# EasyEDA Pro project 磁感应板-1.0.eprj

# Schematic Schematic1
Create Date: 2023-02-28; Page Name: P1; Project Name: 磁感应板-1.0; Schematic Name: Schematic1; Update Date: 2023-04-02
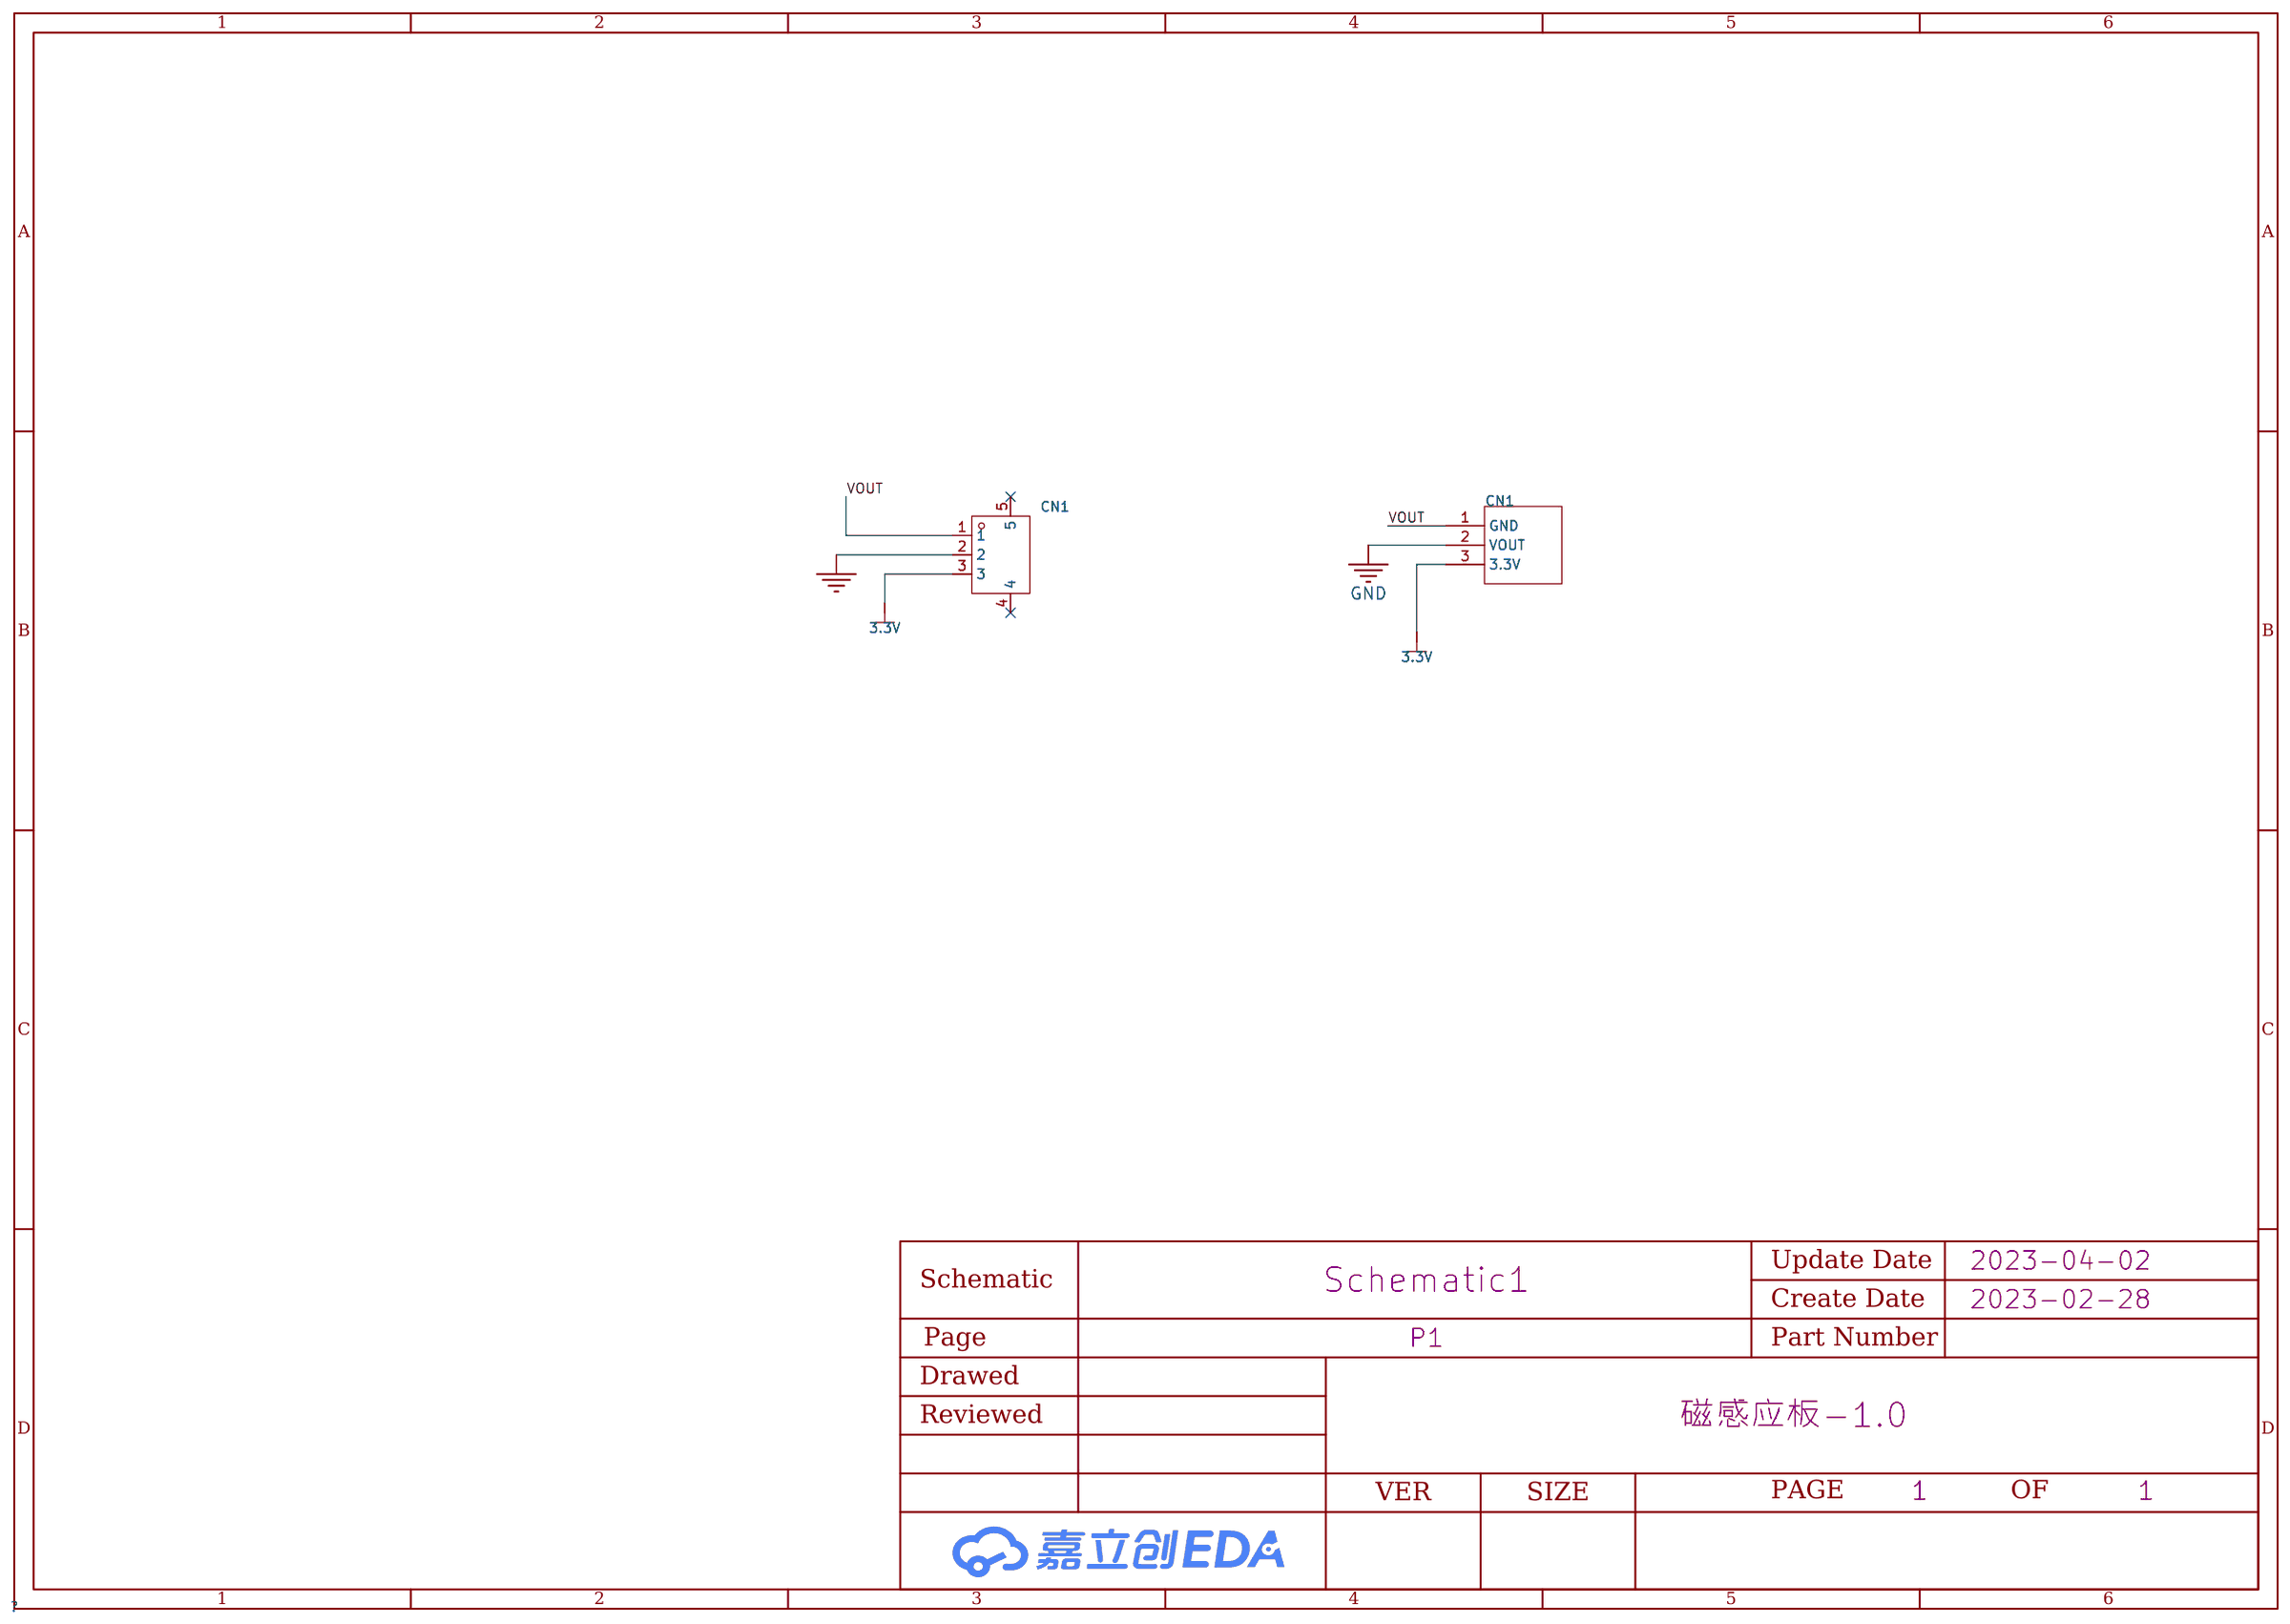
[diagram p0: schematic sheet]

## Parts
CN1  -  [3POINT]
CN1#2  ZH-3PWB  [CONN-SMD_3P-P1.50_DEALON_ZH-3PWB]

## Library data of the parts
CN1 = 3POINT
CN1#2 = ZH-3PWB: 参考系列:ZH;间距:1.5mm;插针结构:1x3P;排数:1;每排PIN数:3;行距:-;公母:公型插针;安装方式:卧贴;额定电流:1A;工作温度范围:-25~+85;; LCSC Part Name: ZH 1.5mm 1x3P 卧贴; Supplier Part: C2905015; Manufacturer: DEALON(德艺隆); Supplier Footprint: SMD,P=1.5mm; JLCPCB Part Class: Extended Part; Datasheet: https://atta.szlcsc.com/upload/public/pdf/source/20211025/0472E62A90AA7D6E290CF88C78AD145A.pdf; Supplier: LCSC; Reference Series: ZH; Pitch: 1.5mm; Pins Structure: 1x3P; Number of Rows: 1; Number of PINs Per Row: 3; Gender: 公型插针; Mounting Style: 卧贴; Current Rating (Max): 1A; Operating Temperature Range: -25~+85

## Nets
3.3V: CN1.3(3.3V) CN1#2.3
GND: CN1.2(VOUT) CN1#2.2
VOUT: CN1.1(GND) CN1#2.1

Not connected (* = marked no-connect by the designer): CN1#2 4* 5*

# Board PCB1
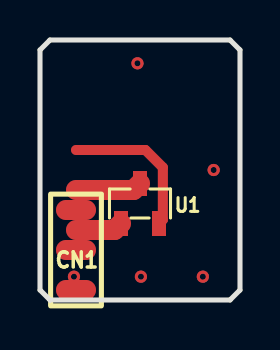
[diagram p1: board, top side]
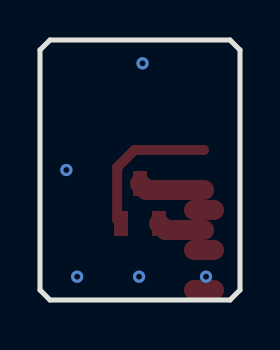
[diagram p2: board, bottom side, seen from below]

Outline 10 x 13 mm; copper layers: Top Layer, Bottom Layer. Coordinates in mm from the lower left corner of the outline.
Outline path: 0,12.5 0,0.5 0.5,0 9.5,0 10,0.5 10,12.5 9.5,13 0.5,13 0,12.5
Stack: Top Layer 0.035mm / Dielectric1 1.51mm FR4 er 4.5 / Bottom Layer 0.035mm

## Design rules (mm)
spacing safeClearance (default): track to track 0.152, other pairs 0.152 to 0.3
track width trackWidth (default): min 0.127, default 0.254, max 2.54
differential pair differentialPair (default): width min 0.127, default 0.254, max 2.54; gap min 0.152, default 0.152
via viaSize (default): diameter min 0.5, default 0.61, max 10; hole min 0.3, default 0.305, max 6

## Placement (name value [footprint] x y rotation side)
CN1  -  [3POINT]  1.8 5.5 270 top
U1  -  [SOT-23-3_L2.9-W1.3-P1.90-LS2.4]  5 4.83 270 top

## Footprints (pads in the part's own frame, mm; a bottom-side part is the same pattern mirrored in y, then rotated)
3POINT
  oval 1x2 smd: 1(1,0) 2(3,0) 3(5,0)
SOT-23-3_L2.9-W1.3-P1.90-LS2.4
  rect 1.25x0.7 smd: 1(1,-0.95) 2(1,0.95) 3(-1,0)

## Nets
3.3V: CN1.3 U1.1
GND: CN1.2 U1.3
VOUT: CN1.1 U1.2

## Via types
v1: diameter 0.61, hole 0.305, Top Layer to Bottom Layer, 5 vias

## Routing (per net, layer and track width the routed paths; a pad name or vN(x,y) marks a point on that pad's centre or on a via; arc(x,y) is an arc through that point)
3.3V: length 2.4
  Top Layer w1: U1.1 3.72,3.5 1.8,3.5
GND: length 3.3
  Top Layer w1: U1.3 4.68,5.5 1.8,5.5
  vias: v1(1.7,1.17) v1(4.87,11.83) v1(5.05,1.17) v1(8.14,1.17) v1(8.68,6.5)
VOUT: length 7.6
  Top Layer w0.5: 1.8,7.5 5.27,7.5 6.14,6.63 6.14,4.02 U1.2
